# EAGLE schematic Standard_Servo_Header (EAGLE 6.5.0)
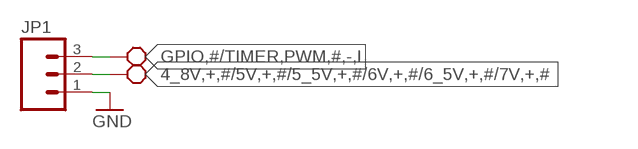
[diagram p0: schematic, sheet 1]

## Parts
JP1  M03LONGPADS  [1X03_LONGPADS]

## Nets
4_8V,+,#/5V,+,#/5_5V,+,#/6V,+,#/6_5V,+,#/7V,+,#: JP1.2 ; supply symbol labelled BLOCK_REQUIREMENT
GND: JP1.1
Unconnected: JP1.3

## Library data of the parts
JP1 = SparkFun:M03: Header 3 Standard 3-pin 0.1" header. Use with straight break away headers (SKU : PRT-00116), right angle break away headers (PRT-00553), swiss pins (PRT-00743), machine pins (PRT-00117), and female headers (PRT-00115). Molex polarized connector foot print use with SKU : PRT-08232 with associated crimp pins and housings.